# EAGLE design uv-dosimeter-featherwing-mk-2.0 (EAGLE 7.5.0)
AUTHOR: sean@yak.net
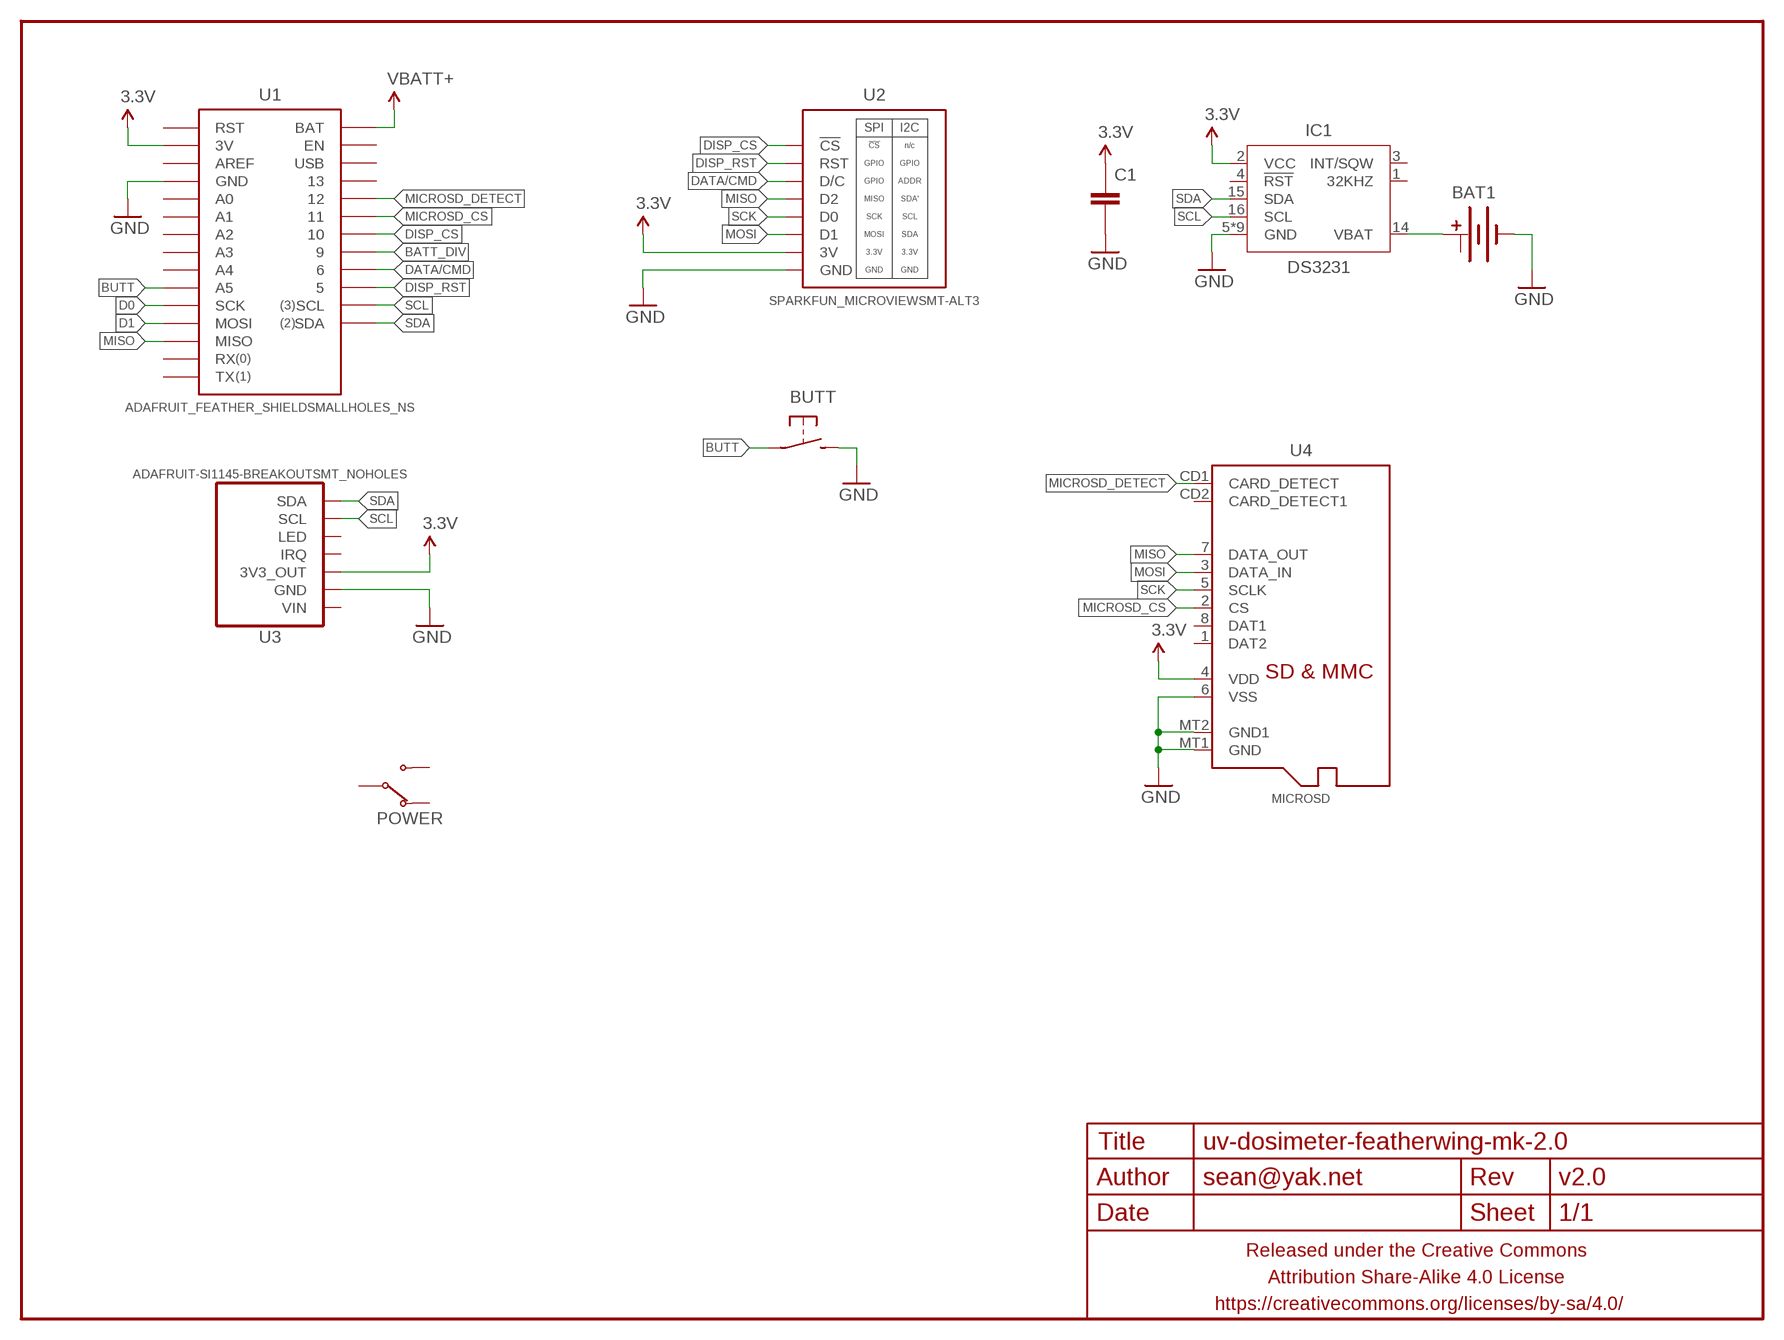
[diagram p0: schematic, sheet 1]

## Parts
BAT1  BATTERY-COINCR1225_SMD_SMALLER  [BATTCON_12MM_SMD]
BUTT  SPST-NO-TACT3MM-SMD  [DTSM-3]
C1  CAPACITOR-CERAMICC0603  [C0603]
FRAME1  FRAME-LETTERNO_PACKAGE  [DUMMY]
IC1  DS3231  [SO16W]
POWER  SWITCH-SPDTSMD-RA  [SWITCH-SPDT-SMD-RA]
U1  ADAFRUIT_FEATHER_SHIELDSMALLHOLES_NS  [ADAFRUIT_FEATHER_SMALLHOLES_NS]
U2  SPARKFUN_MICROVIEWSMT-ALT3  [SPARKFUN-MICROVIEW-SMT-ALT3]
U3  ADAFRUIT-SI1145-BREAKOUTSMT_NOHOLES  [ADAFRUIT-SI1145-BREAKOUT-SMT-NOHOLES]
U4  MICROSD  [MICROSD]

## Nets
3.3V: C1.1 IC1.2(VCC) U1.3V U2.3V U3.3V3(3V3_OUT)
BATT_DIV: U1.9
BUTT: BUTT.1 U1.A5
D0: U1.SCK
D1: U1.MOSI
DATA/CMD: U1.6 U2.D/C
DISP_CS: U1.10 U2.CS(!CS)
DISP_RST: U1.5 U2.RST
GND: BAT1.- BUTT.2 C1.2 IC1.5(GND) IC1.6(GND) IC1.7(GND) IC1.8(GND) IC1.9(GND) IC1.10(GND) IC1.11(GND) IC1.12(GND) IC1.13(GND) U1.GND@0(GND) U1.GND@1(GND) U2.GND U3.GND U4.6(VSS) U4.MT1(GND)
MICROSD_CS: U1.11 U4.2(CS)
MICROSD_DETECT: U1.12 U4.CD1(CARD_DETECT)
MISO: U1.MISO U2.D2 U4.7(DATA_OUT)
MOSI: U2.D1 U4.3(DATA_IN)
N$2: BAT1.+@1(+) IC1.14(VBAT)
SCK: U2.D0 U4.5(SCLK)
SCL: IC1.16(SCL) U1.SCL U3.SCL
SDA: IC1.15(SDA) U1.SDA U3.SDA
VBATT+: U1.BAT
VDD: U4.4(VDD) ; supply symbol labelled 3.3V
Unconnected: BAT1.+@2(+1) IC1.1(32KHZ) IC1.3(INT/SQW) IC1.4(!RST) POWER.1(NO) POWER.2(COM) POWER.3(NC) U1.13 U1.A0 U1.A1 U1.A2 U1.A3 U1.A4 U1.AREF U1.EN U1.RST U1.RX U1.TX U1.USB U3.IRQ U3.LED U3.VIN U4.1(DAT2) U4.8(DAT1) U4.CD2(CARD_DETECT1) U4.MT2(GND1)

## Library data of the parts
BAT1 = a_parts:BATTERY-COIN
BUTT = a_parts:SPST-NO-TACT
C1 = a_parts:CAPACITOR-CERAMIC: CAPACITOR, European symbol
FRAME1 = A_butts:FRAME-LETTER: Schematic Frame Standard 8.5x11 US Letter frame; DESIGNER: sean@yak.net; VERSION: v2.0
IC1 = a_parts:DS3231
POWER = a_parts:SWITCH-SPDT
U1 = a_parts:ADAFRUIT_FEATHER_SHIELD
U2 = a_parts:SPARKFUN_MICROVIEW
U3 = a_parts:ADAFRUIT-SI1145-BREAKOUT
U4 = a_parts:MICROSD: Micro-SD / Transflash card holder with SPI pinout For the 3M # 2908-05WB-MG and/or 4UCON #19656 push-push type

## Board
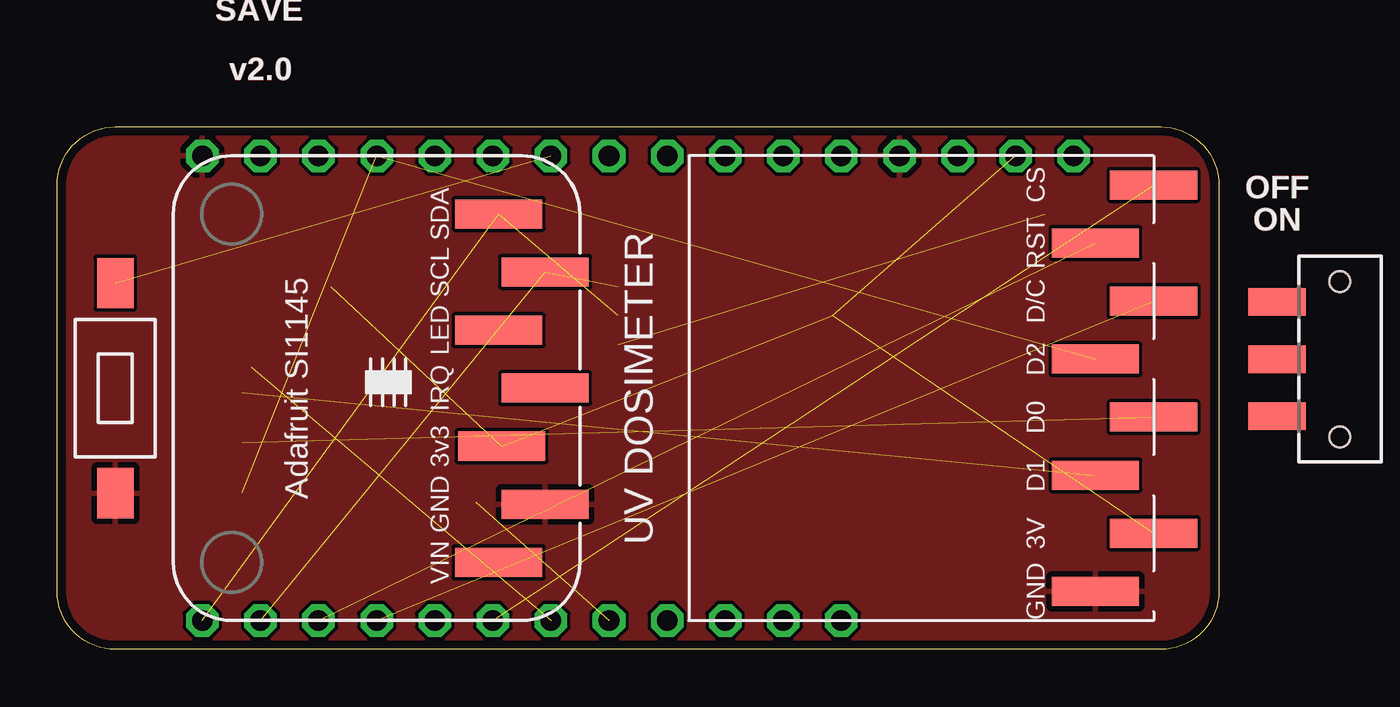
[diagram p1: board, top side]
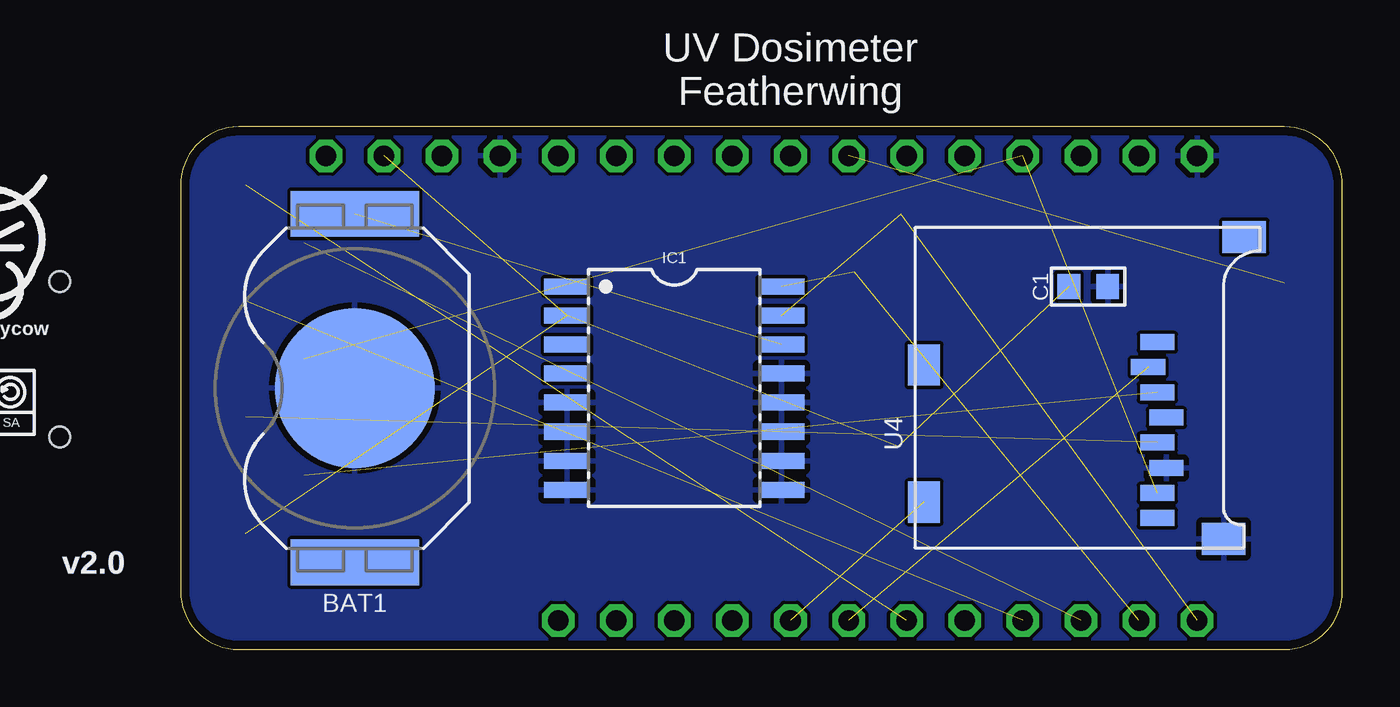
[diagram p2: board, bottom side, seen from below]

Size 50.8 x 22.86 mm. Coordinates in mm from the lower left corner, seen from the top.
Outline: 48.26,0 2.54,0 arc-90 0,2.54 0,20.32 arc-90 2.54,22.86 48.26,22.86 arc-90 50.8,20.32 50.8,2.54 arc-90 48.26,0
Copper layers (1*16): Top 0.0356mm / dielectric 1.5011mm / Bottom 0.0356mm
Design rules "LaenPCBOrder_2": minimum track width 6mil, minimum drill 13mil, track to track 6mil, track to pad 6mil, pad to pad 6mil, via to via 6mil, smd to smd 6mil, copper to edge 15mil, drill to drill 6mil, minimum pad ring 7mil, minimum via ring 7mil, stop-mask expansion 3mil, vias tented up to drill 20mil, thermal gap 10mil

### Footprints (pad centres in the part's own frame; a part is rotated, then mirrored left to right if it is on the bottom)
BATTCON_12MM_SMD = smd 2 x 5.6: +@1 -7.62,0; +@2 7.62,0 | smd 7 x 7: - 0,0
DTSM-3 = smd 2.2 x 1.6: 1 -4.6,0; 2 4.6,0
C0603 = smd 1 x 1.1: 1 -0.85,0; 2 0.85,0
SO16W = smd 0.7 x 2: 1 -4.445,-4.685; 2 -3.175,-4.685; 3 -1.905,-4.685; 4 -0.635,-4.685; 5 0.635,-4.685; 6 1.905,-4.685; 7 3.175,-4.685; 8 4.445,-4.685; 9 4.445,4.685; 10 3.175,4.685; 11 1.905,4.685; 12 0.635,4.685; 13 -0.635,4.685; 14 -1.905,4.685; 15 -3.175,4.685; 16 -4.445,4.685
SWITCH-SPDT-SMD-RA = smd 1.2 x 2.5: 1 -2.5,0; 2 0,0; 3 2.5,0 | hole 0.9: -3.4,-2.75; 3.4,-2.75
ADAFRUIT_FEATHER_SMALLHOLES_NS = drill 0.9 pad 1.422 octagon: 3V -16.51,-10.16; 5 13.97,10.16; 6 11.43,10.16; 9 8.89,10.16; 10 6.35,10.16; 11 3.81,10.16; 12 1.27,10.16; 13 -1.27,10.16; A0 -8.89,-10.16; A1 -6.35,-10.16; A2 -3.81,-10.16; A3 -1.27,-10.16; A4 1.27,-10.16; A5 3.81,-10.16; AREF -13.97,-10.16; BAT -8.89,10.16; EN -6.35,10.16; GND@0 -11.43,-10.16; GND@1 19.05,-10.16; MISO 11.43,-10.16; MOSI 8.89,-10.16; RST -19.05,-10.16; RX 13.97,-10.16; SCK 6.35,-10.16; SCL 16.51,10.16; SDA 19.05,10.16; TX 16.51,-10.16; USB -3.81,10.16
SPARKFUN-MICROVIEW-SMT-ALT3 = smd 1.27 x 3.81: 3V 6.35,10.16; CS -8.89,10.16; D0 1.27,10.16; D1 3.81,7.62; D2 -1.27,7.62; D/C -3.81,10.16; GND 8.89,7.62; RST -6.35,7.62
ADAFRUIT-SI1145-BREAKOUT-SMT-NOHOLES = smd 1.27 x 3.81: 3V3 -2.54,-5.461; GND -5.08,-7.366; IRQ 0,-7.366; LED 2.54,-5.334; SCL 5.08,-7.366; SDA 7.62,-5.334; VIN -7.62,-5.334
MICROSD = smd 0.7 x 1.5: 1 9,-10.64; 2 7.9,-10.24; 3 6.8,-10.64; 4 5.7,-11.04; 5 4.6,-10.64; 6 3.5,-11.04; 7 2.4,-10.64; 8 1.3,-10.64 | smd 1.8 x 1.4: CD1 2,-0.44; CD2 8,-0.44 | smd 1.4 x 1.9: MT1 0.4,-13.54; MT2 13.6,-14.44

### Placement (x,y rotation side)
BAT1  43.18,11.43 270 bottom
BUTT  2.54,11.43 270 top
C1  11.11,15.88 0 bottom
FRAME1  0,0 90 bottom
IC1  29.21,11.43 270 bottom
POWER  53.34,12.7 90 top
U1  25.4,11.43 180 top
U2  37.78,11.43 270 top
U3  13.97,11.43 90 top
U4  18.73,4.45 90 bottom
U$1  [COW_SMALL]  59.05,18.1 0 bottom  (outside the outline)
U$5  [CC-BY-SA-4.0-NO-URL]  60.01,10.79 0 bottom  (outside the outline)

### Tracks (layer width: path | path; a pad name or v marks a point on that pad's centre or on a via)
3.3V  (4 unrouted)
BUTT  (1 unrouted)
DATA/CMD  (1 unrouted)
DISP_CS  (1 unrouted)
DISP_RST  (1 unrouted)
GND
  pour Top (rank 6): 48.26,0 2.54,0 arc-90 0,2.54 0,20.32 arc-90 2.54,22.86 48.26,22.86 arc-90 50.8,20.32 50.8,2.54 arc-90
  pour Bottom (rank 6): 48.26,0 2.54,0 arc-90 0,2.54 0,20.32 arc-90 2.54,22.86 48.26,22.86 arc-90 50.8,20.32 50.8,2.54 arc-90
MICROSD_CS  (1 unrouted)
MICROSD_DETECT  (1 unrouted)
MISO  (2 unrouted)
MOSI  (1 unrouted)
N$2  (1 unrouted)
SCK  (1 unrouted)
SCL  (2 unrouted)
SDA  (2 unrouted)

### Text on the board
Top: SAVE | OFF | ON
tPlace: SAVE | OFF | ON | UV DOSIMETER
bPlace: UV Dosimeter / Featherwing | by schizobovine / <sean@yak.net>